# Altium project PCB_Project stick.PrjPcb
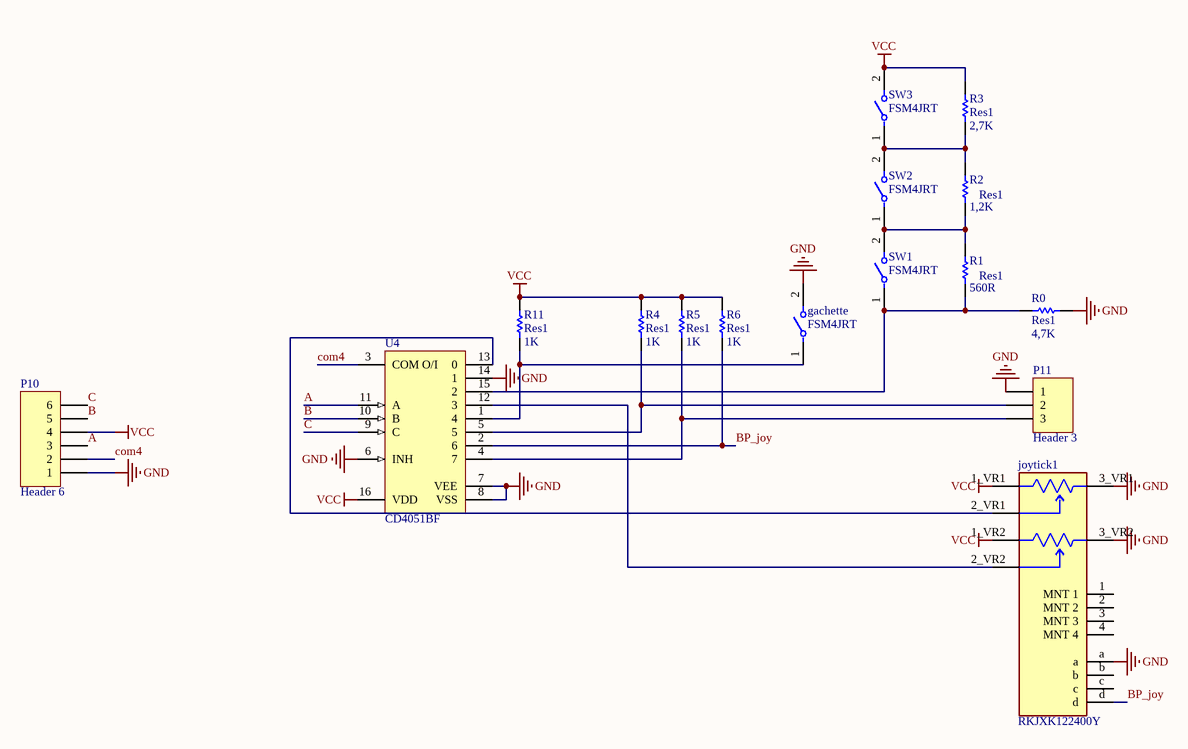
[diagram p0: Sheet1.SchDoc]
1 sheet, 16 parts. Net scope: global (net labels, ports and power ports of the same name join across sheets).
Board file: PCB1.PcbDoc

## Sheet Sheet1.SchDoc
size A3; SheetNumber: 1; SheetTotal: 1

### Parts
gachette  FSM4JRT  [FP-FSM4JRT-MFG]
joytick1  RKJXK122400Y  [FP-RKJXK122400Y-MFG]
P10  Header 6  [HDR1X6]
P11  Header 3  [HDR1X3]
R0  Res1  value 4,7K  [AXIAL-0.3]
R1  Res1  value 560R  [AXIAL-0.3]
R2  Res1  value 1,2K  [AXIAL-0.3]
R3  Res1  value 2,7K  [AXIAL-0.3]
R4  Res1  value 1K  [AXIAL-0.3]
R5  Res1  value 1K  [AXIAL-0.3]
R6  Res1  value 1K  [AXIAL-0.3]
R11  Res1  value 1K  [AXIAL-0.3]
SW1  FSM4JRT  [FP-FSM4JRT-MFG]
SW2  FSM4JRT  [FP-FSM4JRT-MFG]
SW3  FSM4JRT  [FP-FSM4JRT-MFG]
U4  CD4051BF  [J0016A]

### Nets
GND: gachette.2 joytick1.3_VR1(3_VR1) joytick1.3_VR2(3_VR2) joytick1.a P10.1 P11.1 R0.1 U4.6(INH) U4.7(VEE) U4.8(VSS) U4.14(1)
VCC: joytick1.1_VR1(1_VR1) joytick1.1_VR2(1_VR2) P10.4 R3.2 R4.2 R5.2 R6.2 R11.2 SW3.2 U4.16(VDD)
A: P10.3 U4.11(A)
B: P10.5 U4.10(B)
BP_joy: joytick1.d R6.1 U4.2(6)
C: P10.6 U4.9(C)
com4: P10.2 U4.3(COM_O/I)
Netgachette_1: gachette.1 R11.1 U4.1(4)
Netjoytick1_2_VR1: joytick1.2_VR1(2_VR1) U4.13(0)
Netjoytick1_2_VR2: joytick1.2_VR2(2_VR2) U4.12(3)
NetP11_2: P11.2 R4.1 U4.5
NetP11_3: P11.3 R5.1 U4.4(7)
NetR0_2: R0.2 R1.1 SW1.1 U4.15(2)
NetR1_2: R1.2 R2.1 SW1.2 SW2.1
NetR2_2: R2.2 R3.1 SW2.2 SW3.1

Not connected (* = marked no-connect by the designer): joytick1 1(MNT_1) 2(MNT_2) 3(MNT_3) 4(MNT_4) b c

### Library data of the parts
gachette SW1-SW3 = CMP-03407-000038-1: SWITCH TACTILE SPST-NO 0.05A 24V; Current Rating: 50mA; Actuator Diameter: 3.5mm; Max Voltage Rating (DC): 12V; Actuator Length: 0.055inch; Switch Travel: 0.25mm; Actuator Type: Standard; Contact Resistance: 100mR; Illumination Type: Non-Illuminated; Electrical Life: 100000Cycles; Throw Configuration: SPST; Switch Function: Off-Mom; Actuator Material: Resin; Operating Force: 1.57N; Series: FSMJRT; Min Operating Temperature: -35°C; Max Current Rating: 50mA; Termination: PC Pins; Type: Switch; Radiation Hardening: No; Max Operating Temperature: 105°C; Voltage Rating (DC): 12V; Contact Material: Copper Alloy; Contact Current Rating: 50mA; RoHS Compliant: Yes; Mechanical Life: 100000Cycles; Mount: Through Hole; Package Quantity: 10000; Case/Package: Radial; Packaging: Tape and Reel; Length: 6.19mm; Contact Plating: Silver; Depth: 6.19mm; Orientation: Straight
joytick1 = CMP-24118-000005-1: Res POT 10K Ohm 0.0125W (25.4 X 20.7 X 19.3mm) Pin Bracket Mount/Through Hole Tray; Insulation Resistance: 100MR; Resistance: 10kR; Power Rating: 12.5mW; Current Rating: 50mA; Life (Hours): 100Hour; Type: Potentiometer; Mount: Through Hole; Series: RKJXV/ RKJXK; Packaging: Tray; Radiation Hardening: No; Resistor Type: Potentiometer; Termination: Pin; Height: 12.9mm; Military Standard: Not; Min Operating Temperature: -10°C; Max Operating Temperature: 70°C; Package Quantity: 1000; Contact Current Rating: 50mA; Width: 16mm; Depth: 20.7mm; Length: 16mm; RoHS Compliant: Yes
P10 = Header 6: Header, 6-Pin; LatestRevisionDate: 17-Jul-2002; LatestRevisionNote: Re-released for DXP Platform.; Publisher: Altium Limited
P11 = Header 3: Header, 3-Pin; LatestRevisionDate: 17-Jul-2002; LatestRevisionNote: Re-released for DXP Platform.; Publisher: Altium Limited
R0-R6 R11 = Res1: Resistor; Published: 8-Jun-2000; LatestRevisionDate: 17-Jul-2002; LatestRevisionNote: Re-released for DXP Platform.; PackageReference: AXIAL-0.3; Publisher: Altium Limited; PackageDescription: Axial Device, Thru-Hole; 2 Leads; 0.3 in Pin Spacing
U4 = CMP-1575-00057-4: CMOS Single 8-Channel Analog Multiplexer/Demultiplexer with Logic-Level Conversion, J0016A, TUBE; Generic Part Number: CD4051B-MIL; Manufacturer: Texas Instruments; VCC(Max)(V): 18; VCC(Min)(V): 5; Crosstalk: Yes; ICC(Typ)(mA): 0.00008; Bandwidth(Max)(MHz): 20; Ron(Typ)(Ohms): 125; Rating: Military; Ron(Max)(Ohms): 240; Configuration: 1 X 1：8 MUX; PackageReference: J0016A; PackageVersion: http://www.ti.com/lit/ml/mcer002d/mcer002d.pdf; Operating Temperature Range(C): -55 to 125; DatasheetVersion: SCHS047G